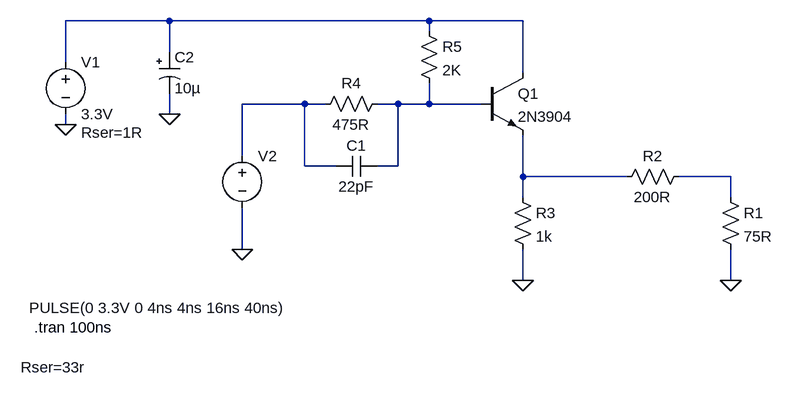
[diagram p0: schematic video buffer.asc]
video buffer.asc, the LTspice schematic file:
Version 4
SHEET 1 1608 680
WIRE -464 -576 -624 -576
WIRE -64 -576 -464 -576
WIRE 80 -576 -64 -576
WIRE -64 -560 -64 -576
WIRE -464 -528 -464 -576
WIRE -624 -512 -624 -576
WIRE 80 -496 80 -576
WIRE -256 -448 -352 -448
WIRE -224 -448 -256 -448
WIRE -112 -448 -144 -448
WIRE -64 -448 -64 -480
WIRE -64 -448 -112 -448
WIRE 16 -448 -64 -448
WIRE -464 -432 -464 -464
WIRE -624 -416 -624 -432
WIRE -352 -368 -352 -448
WIRE -256 -352 -256 -448
WIRE -208 -352 -256 -352
WIRE -112 -352 -112 -448
WIRE -112 -352 -144 -352
WIRE 80 -336 80 -400
WIRE 240 -336 80 -336
WIRE 400 -336 320 -336
WIRE 80 -304 80 -336
WIRE 400 -304 400 -336
WIRE -352 -224 -352 -288
WIRE 80 -176 80 -224
WIRE 400 -176 400 -224
FLAG -624 -416 0
FLAG 400 -176 0
FLAG -352 -224 0
FLAG 80 -176 0
FLAG -464 -432 0
SYMBOL voltage -624 -528 R0
WINDOW 123 0 0 Left 2
WINDOW 39 24 124 Left 2
SYMATTR SpiceLine Rser=1R
SYMATTR InstName V1
SYMATTR Value 3.3V
SYMBOL res 384 -320 R0
SYMATTR InstName R1
SYMATTR Value 75R
SYMBOL npn3 16 -496 R0
SYMATTR InstName Q1
SYMATTR Value 2N3904
SYMBOL voltage -352 -384 R0
WINDOW 3 -328 250 Left 2
WINDOW 123 0 0 Left 2
WINDOW 39 -341 342 Left 2
SYMATTR Value PULSE(0 3.3V 0 4ns 4ns 16ns 40ns)
SYMATTR SpiceLine Rser=33r
SYMATTR InstName V2
SYMBOL res 336 -352 R90
WINDOW 0 0 56 VBottom 2
WINDOW 3 32 56 VTop 2
SYMATTR InstName R2
SYMATTR Value 200R
SYMBOL res 64 -320 R0
SYMATTR InstName R3
SYMATTR Value 1k
SYMBOL res -128 -464 R90
WINDOW 0 0 56 VBottom 2
WINDOW 3 32 56 VTop 2
SYMATTR InstName R4
SYMATTR Value 475R
SYMBOL cap -144 -368 R90
WINDOW 0 0 32 VBottom 2
WINDOW 3 32 32 VTop 2
SYMATTR InstName C1
SYMATTR Value 22pF
SYMBOL polcap -480 -528 R0
WINDOW 3 24 56 Left 2
SYMATTR Value 10µ
SYMATTR InstName C2
SYMATTR Description Capacitor
SYMATTR Type cap
SYMATTR SpiceLine V=6.3 Irms=0 Rser=10 Lser=0
SYMBOL res -80 -576 R0
SYMATTR InstName R5
SYMATTR Value 2K
TEXT -672 -104 Left 2 !.tran 100ns

The netlist it stands for:
* video buffer.asc
V1 N001 0 3.3V Rser=1R
R1 N005 0 75R
Q1 N001 N003 N004 0 2N3904
V2 N002 0 PULSE(0 3.3V 0 4ns 4ns 16ns 40ns) Rser=33r
R2 N005 N004 200R
R3 N004 0 1k
R4 N003 N002 475R
C1 N003 N002 22pF
C2 N001 0 10µ V=6.3 Irms=0 Rser=10 Lser=0
R5 N001 N003 2K
.model NPN NPN
.model PNP PNP
.lib standard.bjt
.tran 100ns
.backanno
.end